# Altium schematic sheet Whitespace_Daughtercard_spi_mux.SchDoc: Serial Interface MUXes
size A; Author: Ryan E. Guerra; Revision: 1.0; SheetNumber: 6; SheetTotal: 10
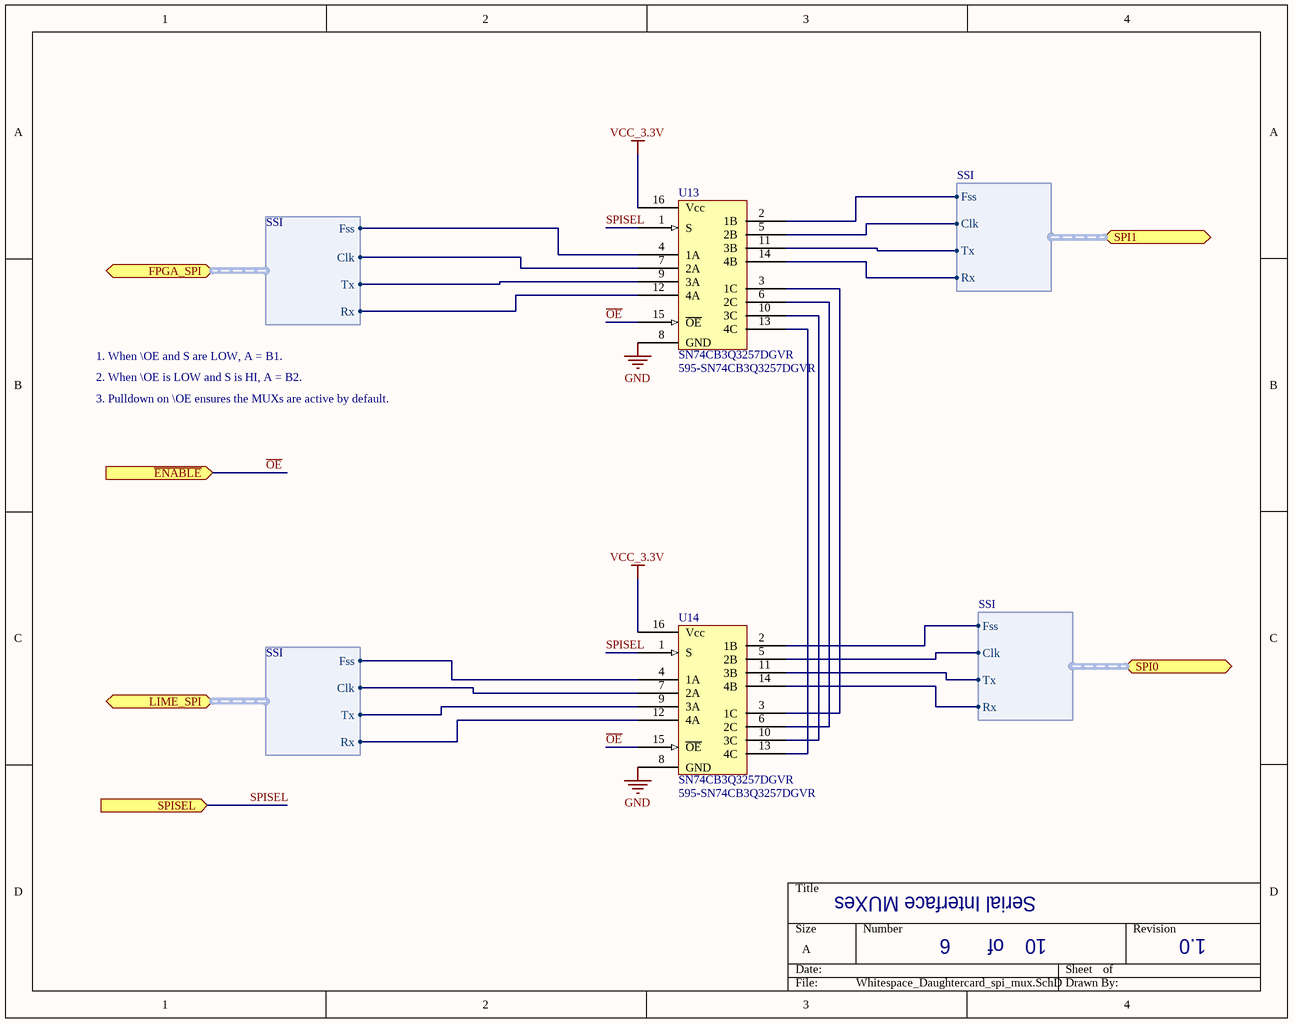
[diagram p0: Whitespace_Daughtercard_spi_mux.SchDoc]

## Parts
U13  SN74CB3Q3257DGVR  Supplier Part Number 1: 595-SN74CB3Q3257DGVR  [TVSOP16_v5]
U14  SN74CB3Q3257DGVR  Supplier Part Number 1: 595-SN74CB3Q3257DGVR  [TVSOP16_v5]

## Ports
FPGA_SPI (harness SSI), LIME_SPI (harness SSI), SPI0 (harness SSI), SPI1 (harness SSI), SPISEL (in), ~{ENABLE} (in)

## Harnesses
SSI: Fss, Clk, Tx, Rx

## Nets
GND: U13.8(GND) U14.8(GND)
VCC_3.3V: U13.16(Vcc) U14.16(Vcc)
~{OE}: U13.15(~{OE}) U14.15(~{OE}) ; port ~{ENABLE}
SPISEL: U13.1(S) U14.1(S) ; port SPISEL
NetU13_2: U13.2(1B) ; port SPI1.Fss
NetU13_3: U13.3(1C) U14.3(1C)
NetU13_4: U13.4(1A) ; port FPGA_SPI.Fss
NetU13_5: U13.5(2B) ; port SPI1.Clk
NetU13_6: U13.6(2C) U14.6(2C)
NetU13_7: U13.7(2A) ; port FPGA_SPI.Clk
NetU13_9: U13.9(3A) ; port FPGA_SPI.Tx
NetU13_10: U13.10(3C) U14.10(3C)
NetU13_11: U13.11(3B) ; port SPI1.Tx
NetU13_12: U13.12(4A) ; port FPGA_SPI.Rx
NetU13_13: U13.13(4C) U14.13(4C)
NetU13_14: U13.14(4B) ; port SPI1.Rx
NetU14_2: U14.2(1B) ; port SPI0.Fss
NetU14_4: U14.4(1A) ; port LIME_SPI.Fss
NetU14_5: U14.5(2B) ; port SPI0.Clk
NetU14_7: U14.7(2A) ; port LIME_SPI.Clk
NetU14_9: U14.9(3A) ; port LIME_SPI.Tx
NetU14_11: U14.11(3B) ; port SPI0.Tx
NetU14_12: U14.12(4A) ; port LIME_SPI.Rx
NetU14_14: U14.14(4B) ; port SPI0.Rx

## Notes on the sheet
- 1. When \OE and S are LOW, A = B1.
- 2. When \OE is LOW and S is HI, A = B2.
- 3. Pulldown on \OE ensures the MUXs are active by default.
- of

## Library data of the parts
U13 U14 = SN74CB3Q3257DGVR: 4-bit MUX/DEMUX 1-of-2  0-5V SIG 3.3V CTRL TVSOP-16; Supplier 1: Mouser